# EAGLE schematic HexJacks_panel (EAGLE 6.6.0)
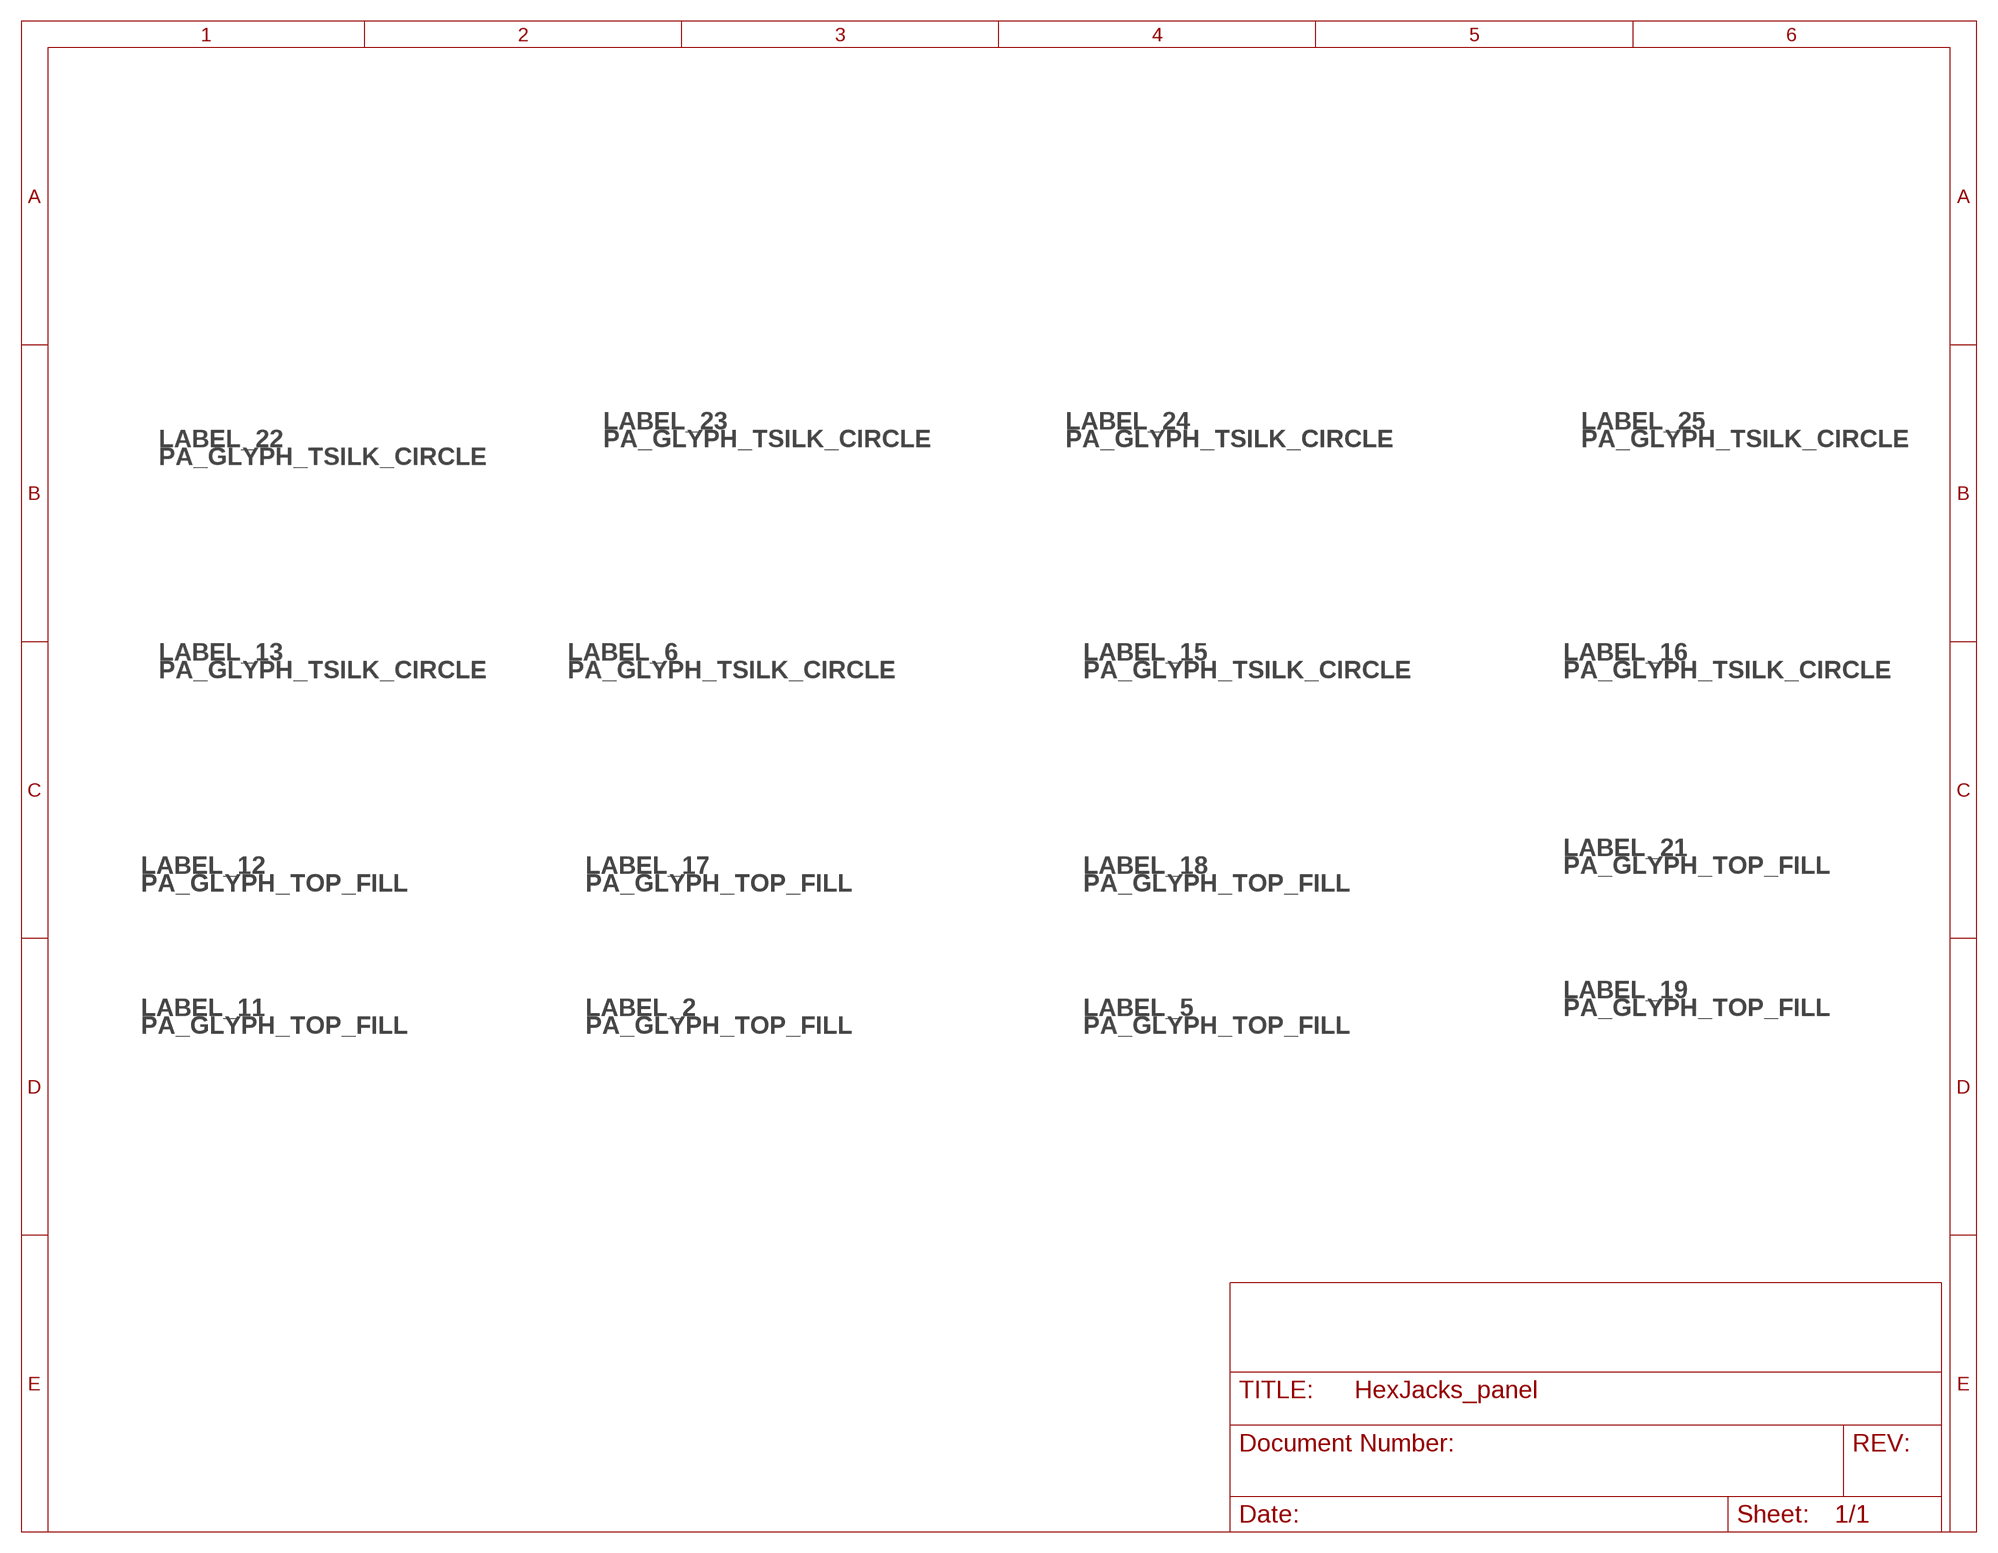
[diagram p0: schematic, sheet 1]

## Parts
LABEL_2  PA_GLYPH_TOP_FILL  [GLY_TOP_FILL]
LABEL_5  PA_GLYPH_TOP_FILL  [GLY_TOP_FILL]
LABEL_6  PA_GLYPH_TSILK_CIRCLE  [GLY_TSILK_CIRCLE]
LABEL_11  PA_GLYPH_TOP_FILL  [GLY_TOP_FILL]
LABEL_12  PA_GLYPH_TOP_FILL  [GLY_TOP_FILL]
LABEL_13  PA_GLYPH_TSILK_CIRCLE  [GLY_TSILK_CIRCLE]
LABEL_15  PA_GLYPH_TSILK_CIRCLE  [GLY_TSILK_CIRCLE]
LABEL_16  PA_GLYPH_TSILK_CIRCLE  [GLY_TSILK_CIRCLE]
LABEL_17  PA_GLYPH_TOP_FILL  [GLY_TOP_FILL]
LABEL_18  PA_GLYPH_TOP_FILL  [GLY_TOP_FILL]
LABEL_19  PA_GLYPH_TOP_FILL  [GLY_TOP_FILL]
LABEL_21  PA_GLYPH_TOP_FILL  [GLY_TOP_FILL]
LABEL_22  PA_GLYPH_TSILK_CIRCLE  [GLY_TSILK_CIRCLE]
LABEL_23  PA_GLYPH_TSILK_CIRCLE  [GLY_TSILK_CIRCLE]
LABEL_24  PA_GLYPH_TSILK_CIRCLE  [GLY_TSILK_CIRCLE]
LABEL_25  PA_GLYPH_TSILK_CIRCLE  [GLY_TSILK_CIRCLE]

## Library data of the parts
LABEL_2 LABEL_5 LABEL_6 LABEL_11-LABEL_13 LABEL_15-LABEL_19 LABEL_21-LABEL_25 = PatternAgents-Logos:PA_GLYPH